# EAGLE design tiles (EAGLE 9.5.2)
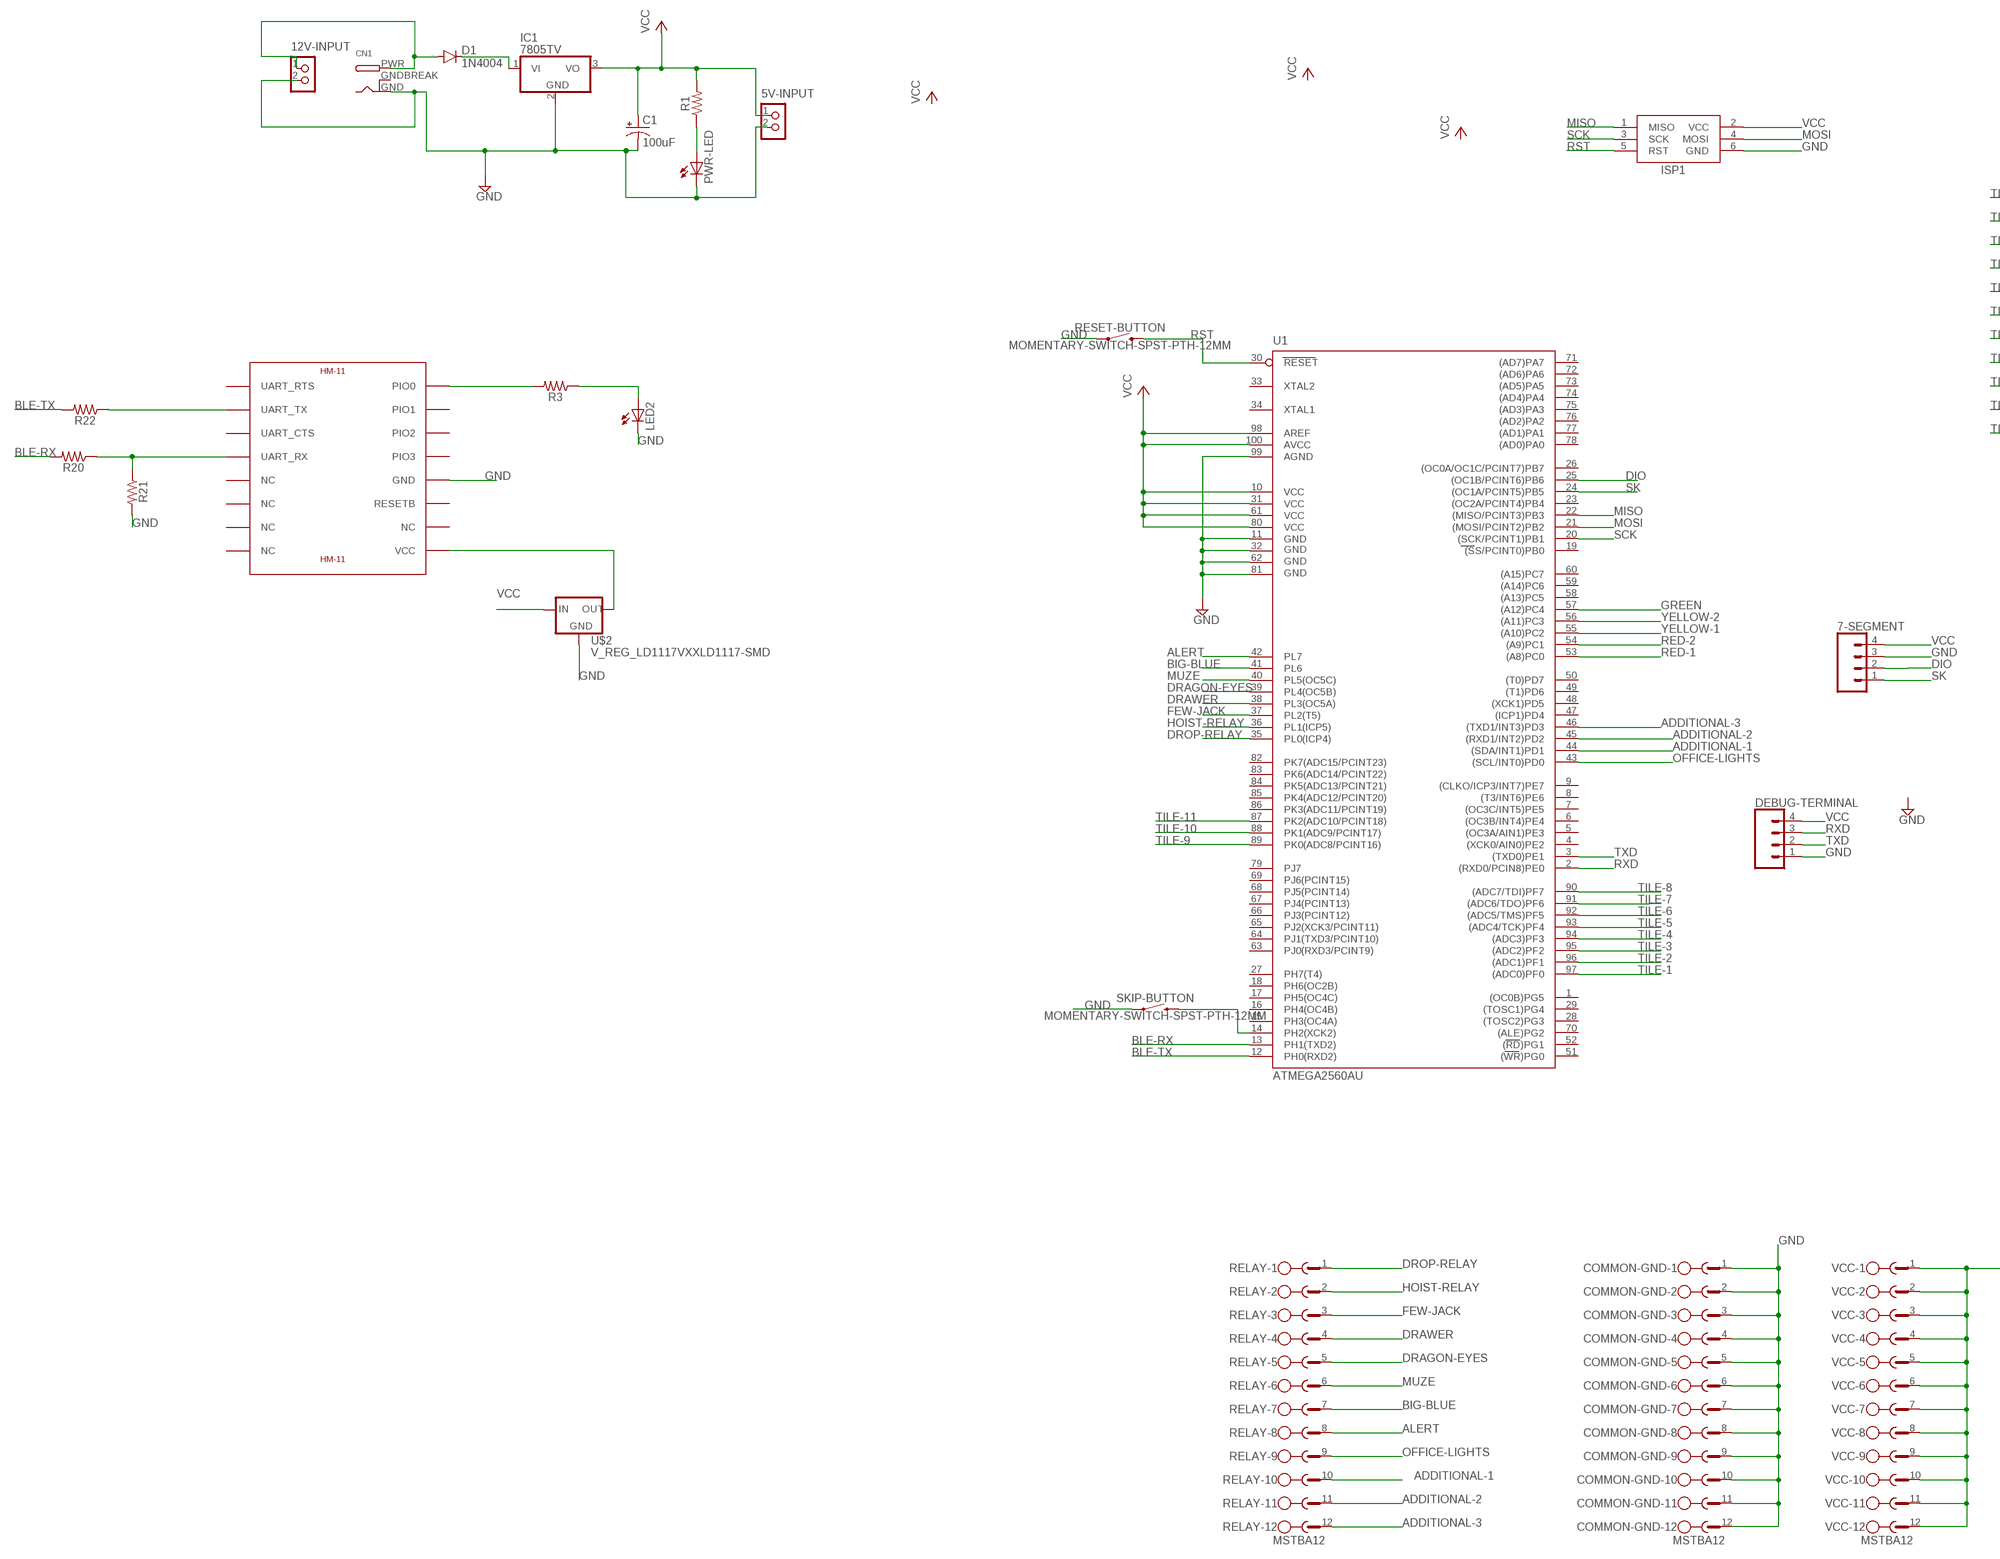
[diagram p0: schematic, sheet 1, part 1 of 2]
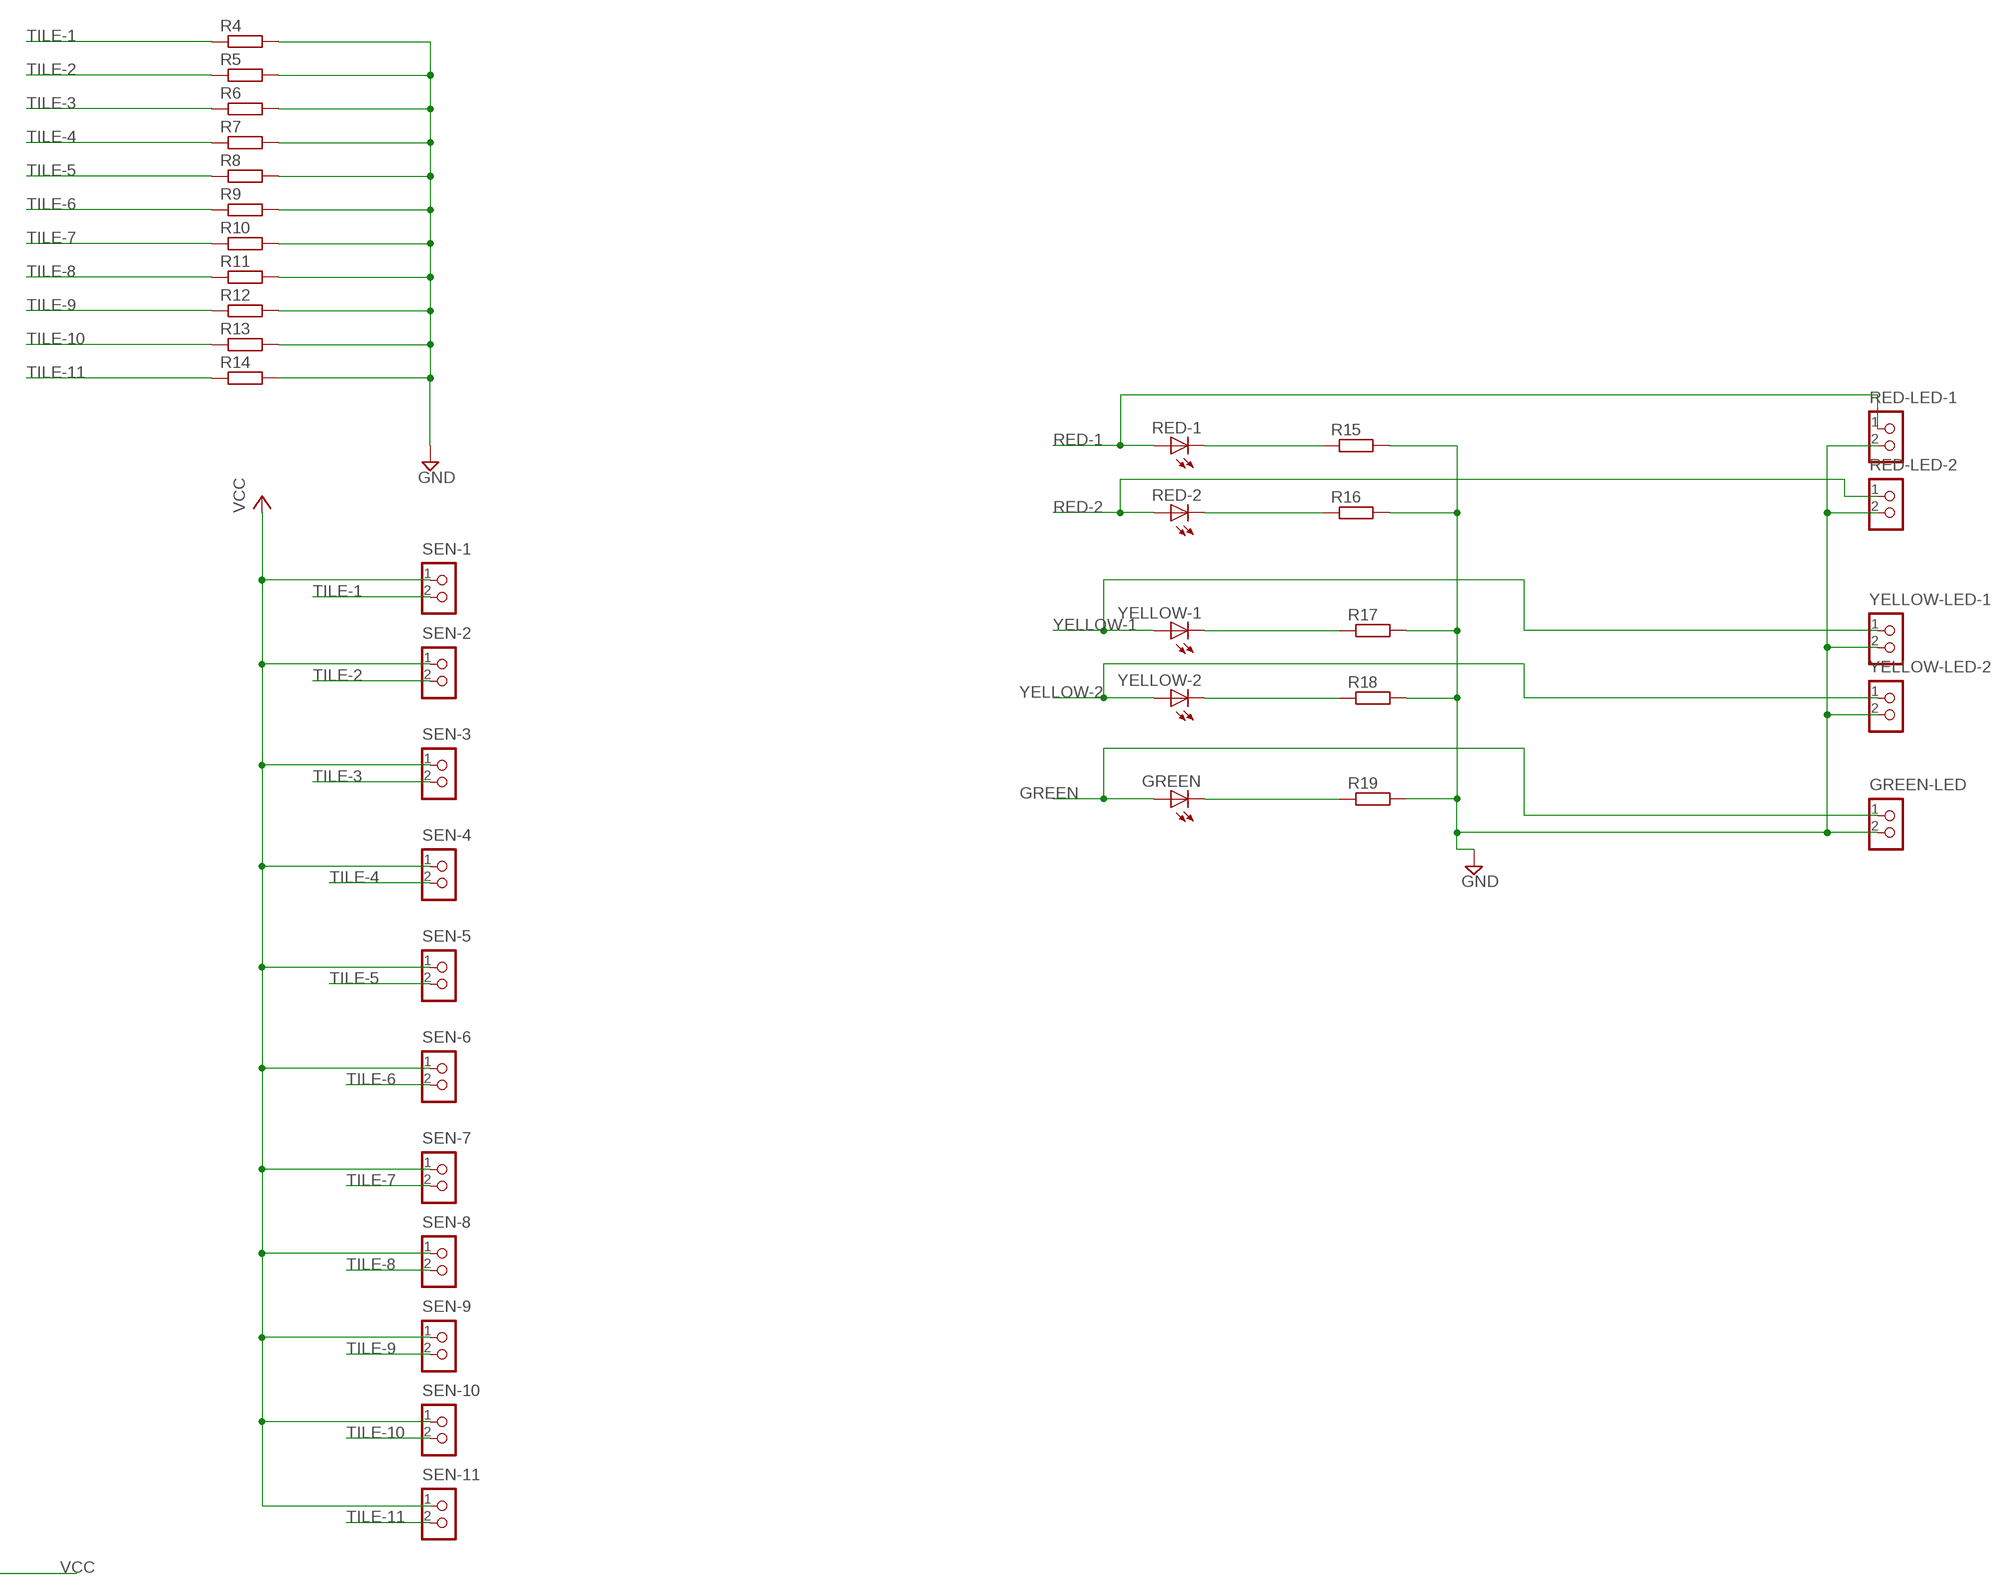
[diagram p1: schematic, sheet 1, part 2 of 2]

## Parts
5V-INPUT  CON_TERMINAL_BLOCK_02-5MM  [TERMINAL_BLOCK_2P_5]
7-SEGMENT  CONN_04PTH  [1X04]
12V-INPUT  CON_TERMINAL_BLOCK_02-5MM  [TERMINAL_BLOCK_2P_5]
C1  100uF  100UF-POLAR-RADIAL-2.5MM-25V-20%  [CPOL-RADIAL-2.5MM-6.5MM]
CN1  DCBARRELPTH  [DCJACK_2MM_PTH]
COMMON-GND  MSTBA12  [MSTBA12]
D1  1N4004  [DO41-10]
DEBUG-TERMINAL  CONN_04PTH  [1X04]
GREEN  LED5MM  [LED5MM]
GREEN-LED  CON_TERMINAL_BLOCK_02-5MM  [TERMINAL_BLOCK_2P_5]
IC1  7805TV  [TO220V]
ISP1  AVRISP-6  [AVRISP]
LED2  LED1206  [LED-1206]
PWR-LED  LED1206  [LED-1206]
R1  RESISTOR1206  [1206]
R3  RESISTOR1206  [1206]
R4  R-EU_0204/7  [0204/7]
R5  R-EU_0204/7  [0204/7]
R6  R-EU_0204/7  [0204/7]
R7  R-EU_0204/7  [0204/7]
R8  R-EU_0204/7  [0204/7]
R9  R-EU_0204/7  [0204/7]
R10  R-EU_0204/7  [0204/7]
R11  R-EU_0204/7  [0204/7]
R12  R-EU_0204/7  [0204/7]
R13  R-EU_0204/7  [0204/7]
R14  R-EU_0204/7  [0204/7]
R15  R-EU_0204/7  [0204/7]
R16  R-EU_0204/7  [0204/7]
R17  R-EU_0204/7  [0204/7]
R18  R-EU_0204/7  [0204/7]
R19  R-EU_0204/7  [0204/7]
R20  RESISTOR1206  [1206]
R21  RESISTOR1206  [1206]
R22  RESISTOR1206  [1206]
RED-1  LED5MM  [LED5MM]
RED-2  LED5MM  [LED5MM]
RED-LED-1  CON_TERMINAL_BLOCK_02-5MM  [TERMINAL_BLOCK_2P_5]
RED-LED-2  CON_TERMINAL_BLOCK_02-5MM  [TERMINAL_BLOCK_2P_5]
RELAY  MSTBA12  [MSTBA12]
RESET-BUTTON  MOMENTARY-SWITCH-SPST-PTH-12MM  [TACTILE_SWITCH_PTH_12MM]
SEN-1  CON_TERMINAL_BLOCK_02-5MM  [TERMINAL_BLOCK_2P_5]
SEN-2  CON_TERMINAL_BLOCK_02-5MM  [TERMINAL_BLOCK_2P_5]
SEN-3  CON_TERMINAL_BLOCK_02-5MM  [TERMINAL_BLOCK_2P_5]
SEN-4  CON_TERMINAL_BLOCK_02-5MM  [TERMINAL_BLOCK_2P_5]
SEN-5  CON_TERMINAL_BLOCK_02-5MM  [TERMINAL_BLOCK_2P_5]
SEN-6  CON_TERMINAL_BLOCK_02-5MM  [TERMINAL_BLOCK_2P_5]
SEN-7  CON_TERMINAL_BLOCK_02-5MM  [TERMINAL_BLOCK_2P_5]
SEN-8  CON_TERMINAL_BLOCK_02-5MM  [TERMINAL_BLOCK_2P_5]
SEN-9  CON_TERMINAL_BLOCK_02-5MM  [TERMINAL_BLOCK_2P_5]
SEN-10  CON_TERMINAL_BLOCK_02-5MM  [TERMINAL_BLOCK_2P_5]
SEN-11  CON_TERMINAL_BLOCK_02-5MM  [TERMINAL_BLOCK_2P_5]
SKIP-BUTTON  MOMENTARY-SWITCH-SPST-PTH-12MM  [TACTILE_SWITCH_PTH_12MM]
U1  ATMEGA2560AU  [TQFP100]
U$1  HM-11  [HM-11]
U$2  V_REG_LD1117VXXLD1117-SMD  [SOT223]
VCC  MSTBA12  [MSTBA12]
YELLOW-1  LED5MM  [LED5MM]
YELLOW-2  LED5MM  [LED5MM]
YELLOW-LED-1  CON_TERMINAL_BLOCK_02-5MM  [TERMINAL_BLOCK_2P_5]
YELLOW-LED-2  CON_TERMINAL_BLOCK_02-5MM  [TERMINAL_BLOCK_2P_5]

## Nets
ADDITIONAL-1: RELAY.10 U1.44((SDA/INT1)PD1)
ADDITIONAL-2: RELAY.11 U1.45((RXD1/INT2)PD2)
ADDITIONAL-3: RELAY.12 U1.46((TXD1/INT3)PD3)
ALERT: RELAY.8 U1.42(PL7)
BIG-BLUE: RELAY.7 U1.41(PL6)
BLE-RX: R20.2 U1.13(PH1(TXD2))
BLE-TX: R22.2 U1.12(PH0(RXD2))
DIO: 7-SEGMENT.2 U1.25((OC1B/PCINT6)PB6)
DRAGON-EYES: RELAY.5 U1.39(PL4(OC5B))
DRAWER: RELAY.4 U1.38(PL3(OC5A))
DROP-RELAY: RELAY.1 U1.35(PL0(ICP4))
FEW-JACK: RELAY.3 U1.37(PL2(T5))
GND: 5V-INPUT.2 7-SEGMENT.3 12V-INPUT.2 C1.2(-) CN1.GND COMMON-GND.1 COMMON-GND.2 COMMON-GND.3 COMMON-GND.4 COMMON-GND.5 COMMON-GND.6 COMMON-GND.7 COMMON-GND.8 COMMON-GND.9 COMMON-GND.10 COMMON-GND.11 COMMON-GND.12 DEBUG-TERMINAL.1 GREEN-LED.2 IC1.2(GND) ISP1.6(GND) LED2.C PWR-LED.C R4.2 R5.2 R6.2 R7.2 R8.2 R9.2 R10.2 R11.2 R12.2 R13.2 R14.2 R15.2 R16.2 R17.2 R18.2 R19.2 R21.2 RED-LED-1.2 RED-LED-2.2 RESET-BUTTON.1 SKIP-BUTTON.1 U1.11(GND) U1.32(GND1) U1.62(GND2) U1.81(GND3) U1.99(AGND) U$1.GND U$2.1(GND) YELLOW-LED-1.2 YELLOW-LED-2.2
GREEN: GREEN-LED.1 GREEN.A U1.57((A12)PC4)
HOIST-RELAY: RELAY.2 U1.36(PL1(ICP5))
MISO: ISP1.1(MISO) U1.22((MISO/PCINT3)PB3)
MOSI: ISP1.4(MOSI) U1.21((MOSI/PCINT2)PB2)
MUZE: RELAY.6 U1.40(PL5(OC5C))
N$1: 12V-INPUT.1 CN1.PWR D1.A
N$2: D1.C IC1.1(VI)
N$3: R3.2 U$1.PIO0
N$4: PWR-LED.A R1.1
N$5: R15.1 RED-1.K(C)
N$6: R16.1 RED-2.K(C)
N$7: R17.1 YELLOW-1.K(C)
N$8: R18.1 YELLOW-2.K(C)
N$9: GREEN.K(C) R19.1
N$10: SKIP-BUTTON.3 U1.14(PH2(XCK2))
N$11: LED2.A R3.1
N$12: U$1.VCC U$2.2(OUT)
N$13: R20.1 R21.1 U$1.UART_RX
N$15: R22.1 U$1.UART_TX
OFFICE-LIGHTS: RELAY.9 U1.43((SCL/INT0)PD0)
RED-1: RED-1.A RED-LED-1.1 U1.53((A8)PC0)
RED-2: RED-2.A RED-LED-2.1 U1.54((A9)PC1)
RST: ISP1.5(RST) RESET-BUTTON.3 U1.30(RESET)
RXD: DEBUG-TERMINAL.3 U1.2((RXD0/PCIN8)PE0)
SCK: ISP1.3(SCK) U1.20((SCK/PCINT1)PB1)
SK: 7-SEGMENT.1 U1.24((OC1A/PCINT5)PB5)
TILE-1: R4.1 SEN-1.2 U1.97((ADC0)PF0)
TILE-2: R5.1 SEN-2.2 U1.96((ADC1)PF1)
TILE-3: R6.1 SEN-3.2 U1.95((ADC2)PF2)
TILE-4: R7.1 SEN-4.2 U1.94((ADC3)PF3)
TILE-5: R8.1 SEN-5.2 U1.93((ADC4/TCK)PF4)
TILE-6: R9.1 SEN-6.2 U1.92((ADC5/TMS)PF5)
TILE-7: R10.1 SEN-7.2 U1.91((ADC6/TDO)PF6)
TILE-8: R11.1 SEN-8.2 U1.90((ADC7/TDI)PF7)
TILE-9: R12.1 SEN-9.2 U1.89(PK0(ADC8/PCINT16))
TILE-10: R13.1 SEN-10.2 U1.88(PK1(ADC9/PCINT17))
TILE-11: R14.1 SEN-11.2 U1.87(PK2(ADC10/PCINT18))
TXD: DEBUG-TERMINAL.2 U1.3((TXD0)PE1)
VCC: 5V-INPUT.1 7-SEGMENT.4 C1.1(+) DEBUG-TERMINAL.4 IC1.3(VO) ISP1.2(VCC) R1.2 SEN-1.1 SEN-2.1 SEN-3.1 SEN-4.1 SEN-5.1 SEN-6.1 SEN-7.1 SEN-8.1 SEN-9.1 SEN-10.1 SEN-11.1 U1.10(VCC) U1.31(VCC1) U1.61(VCC2) U1.80(VCC3) U1.98(AREF) U1.100(AVCC) U$2.3(IN) VCC.1 VCC.2 VCC.3 VCC.4 VCC.5 VCC.6 VCC.7 VCC.8 VCC.9 VCC.10 VCC.11 VCC.12
YELLOW-1: U1.55((A10)PC2) YELLOW-1.A YELLOW-LED-1.1
YELLOW-2: U1.56((A11)PC3) YELLOW-2.A YELLOW-LED-2.1
Unconnected: U1.1((OC0B)PG5) U1.4((XCK0/AIN0)PE2) U1.5((OC3A/AIN1)PE3) U1.6((OC3B/INT4)PE4) U1.7((OC3C/INT5)PE5) U1.8((T3/INT6)PE6) U1.9((CLKO/ICP3/INT7)PE7) U1.15(PH3(OC4A)) U1.16(PH4(OC4B)) U1.17(PH5(OC4C)) U1.18(PH6(OC2B)) U1.19((SS/PCINT0)PB0) U1.23((OC2A/PCINT4)PB4) U1.26((OC0A/OC1C/PCINT7)PB7) U1.27(PH7(T4)) U1.28((TOSC2)PG3) U1.29((TOSC1)PG4) U1.33(XTAL2) U1.34(XTAL1) U1.47((ICP1)PD4) U1.48((XCK1)PD5) U1.49((T1)PD6) U1.50((T0)PD7) U1.51((WR)PG0) U1.52((RD)PG1) U1.58((A13)PC5) U1.59((A14)PC6) U1.60((A15)PC7) U1.63(PJ0(RXD3/PCINT9)) U1.64(PJ1(TXD3/PCINT10)) U1.65(PJ2(XCK3/PCINT11)) U1.66(PJ3(PCINT12)) U1.67(PJ4(PCINT13)) U1.68(PJ5(PCINT14)) U1.69(PJ6(PCINT15)) U1.70((ALE)PG2) U1.71((AD7)PA7) U1.72((AD6)PA6) U1.73((AD5)PA5) U1.74((AD4)PA4) U1.75((AD3)PA3) U1.76((AD2)PA2) U1.77((AD1)PA1) U1.78((AD0)PA0) U1.79(PJ7) U1.82(PK7(ADC15/PCINT23)) U1.83(PK6(ADC14/PCINT22)) U1.84(PK5(ADC13/PCINT21)) U1.85(PK4(ADC12/PCINT20)) U1.86(PK3(ADC11/PCINT19)) U$1.NC@5(NC) U$1.NC@6(NC) U$1.NC@7(NC) U$1.NC@8(NC) U$1.NC@10(NC) U$1.PIO1 U$1.PIO2 U$1.PIO3 U$1.RESETB U$1.UART_CTS U$1.UART_RTS

## Power pins joined to a net without a drawn wire
GNDBREAK: CN1.GNDBREAK

## Library data of the parts
5V-INPUT 12V-INPUT GREEN-LED RED-LED-1 RED-LED-2 SEN-1-SEN-11 YELLOW-LED-1 YELLOW-LED-2 = dp_devices.v6:CON_TERMINAL_BLOCK_02: 2 poles wire to board terminal block
7-SEGMENT DEBUG-TERMINAL = SparkFun-Connectors:CONN_04: Multi connection point. Often used as Generic Header-pin footprint for 0.1 inch spaced/style header connections On any of the 0.1 inch spaced packages, you can populate with these: Break Away Headers - Straight <https://www.sparkfun.com/products/116> (PRT-00116) Break Away Male Headers - Right Angle <https://www.sparkfun.com/products/553> (PRT-00553) Female Headers <https://www.sparkfun.com/products/115> (PRT-00115) Break Away Headers - Machine Pin <https://www.sparkfun.com/products/117> (PRT-00117) Break Away Female Headers - Swiss Machine Pin <https://www.sparkfun.com/products/743> (PRT-00743) For SCREWTERMINALS and SPRING TERMINALS visit here: Screw Terimnals on SparkFun.com <https://www.sparkfun.com/search/results?term=Screw+Terminals> (5mm/3.5mm/2.54mm spacing) This device is also useful as a general connection point to wire up your design to another part of your project. Our various solder wires solder well into these plated through hole pads. Hook-Up Wire - Assortment (Stranded, 22 AWG) <https://www.sparkfun.com/products/11375> (PRT-11375) Hook-Up Wire - Assortment (Solid Core, 22 AWG) <https://www.sparkfun.com/products/11367> (PRT-11367) View the entire wire category on our website here <https://www.sparkfun.com/categories/141> Special notes: Molex polarized connector foot print use with SKU : PRT-08231 with associated crimp pins and housings. 1MM SMD Version SKU: PRT-10208; PROD_ID: CONN-09696
C1 = SparkFun-Capacitors:100UF-POLAR: 100µF polarized capacitors A capacitor is a passive two-terminal electrical component used to store electrical energy temporarily in an electric field.; PROD_ID: CAP-08439
CN1 = adafruit:DCBARREL: 2.0mm DC Barrel Jack DCJACK_2MM_PTH - Through Hole Jack (4UConnector: 05537)
COMMON-GND RELAY VCC = con-phoenix-508:MSTBA12: PHOENIX; MPN: 1757349; OC_FARNELL: 3705250; OC_NEWARK: 71C4169
D1 = diode:1N4004: DIODE general purpose rectifier, 1 A
GREEN RED-1 RED-2 YELLOW-1 YELLOW-2 = adafruit:LED: LED OSRAM: - CHIPLED LG R971, LG N971, LY N971, LG Q971, LY Q971, LO R971, LY R971 LH N974, LH R974 LS Q976, LO Q976, LY Q976 LO Q996 - Hyper CHIPLED LW Q18S LB Q993, LB Q99A, LB R99A - SideLED LS A670, LO A670, LY A670, LG A670, LP A670 LB A673, LV A673, LT A673, LW A673 LH A674 LY A675 LS A676, LA A676, LO A676, LY A676, LW A676 LS A679, LY A679, LG A679 - Hyper Micro SIDELED® LS Y876, LA Y876, LO Y876, LY Y876 LT Y87S - SmartLED LW L88C, LW L88S LB L89C, LB L89S, LG L890 LS L89K, LO L89K, LY L89K LS L896, LA L896, LO L896, LY L896 - TOPLED LS T670, LO T670, LY T670, LG T670, LP T670 LSG T670, LSP T670, LSY T670, LOP T670, LYG T670 LG T671, LOG T671, LSG T671 LB T673, LV T673, LT T673, LW T673 LH T674 LS T676, LA T676, LO T676, LY T676, LB T676, LH T676, LSB T676, LW T676 LB T67C, LV T67C, LT T67C, LS T67K, LO T67K, LY T67K, LW E67C LS E67B, LA E67B, LO E67B, LY E67B, LB E67C, LV E67C, LT E67C LW T67C LS T679, LY T679, LG T679 LS T770, LO T770, LY T770, LG T770, LP T770 LB T773, LV T773, LT T773, LW T773 LH T774 LS E675, LA E675, LY E675, LS T675 LS T776, LA T776, LO T776, LY T776, LB T776 LHGB T686 LT T68C, LB T68C - Hyper Mini TOPLED® LB M676 - Mini TOPLED Santana® LG M470 LS M47K, LO M47K, LY M47K Source: http://www.osram.convergy.de/
IC1 = linear:78*: Positive VOLTAGE REGULATOR Source: http://cache.national.com/ds/LM/LM78L05.pdf http://www.fairchildsemi.com/ds/LM/LM7805.pdf
ISP1 = adafruit:AVRISP: AVR ISP HEADER Standard 6 pin header for AVR programming
LED2 PWR-LED = SparkFun-Retired:LED: LEDs Standard schematic elements and footprints for 5mm, 3mm, 1206, and 0603 sized LEDs. 5mm - Spark Fun Electronics SKU : Comp-SBL
R1 R3 R20-R22 = SparkFun-Resistors:RESISTOR: Generic Resistor Package; SPICEPREFIX: R
R4-R19 = rcl:R-EU_: RESISTOR, European symbol; SPICEPREFIX: R
RESET-BUTTON SKIP-BUTTON = SparkFun-Switches:MOMENTARY-SWITCH-SPST: Momentary Switch (Pushbutton) - SPST Normally-open (NO) SPST momentary switches (buttons, pushbuttons). Variants PTH-12MM - 12mm square, through-hole Momentary Pushbutton Switch - 12mm Square <https://www.sparkfun.com/products/9190> (COM-09190) PTH-6.0MM, PTH-6.0MM-KIT - 6.0mm square, through-hole Mini Pushbutton Switch <https://www.sparkfun.com/products/97> (COM-00097) KIT package intended for soldering kit's - only one side of pads' copper is exposed. PTH-RIGHT-ANGLE-KIT - Right-angle, through-hole Right Angle Tactile Button <https://www.sparkfun.com/products/10791> - Used on SparkFun BigTime Watch Kit <https://www.sparkfun.com/products/11734> SMD-12MM - 12mm square, surface-mount Tactile Button - SMD (12mm) <https://www.sparkfun.com/products/12993> (COM-12993) Used on SparkFun PicoBoard <https://www.sparkfun.com/products/11888> SMD-4.5MM - 4.5mm Square Trackball Switch Used on SparkFun Blackberry Trackballer Breakout <https://www.sparkfun.com/products/13169> SMD-4.6MMX2.8MM - 4.60mm x 2.80mm, surface mount Used on SparkFun SAMD21 Mini Breakout <https://www.sparkfun.com/products/13664> SMD-5.2MM, SMD-5.2-REDUNDANT - 5.2mm square, surface-mount Mini Pushbutton Switch - SMD <https://www.sparkfun.com/products/8720> (COM-08720) Used on Arduino Pro Mini <https://www.sparkfun.com/products/11114> REDUNDANT package connects both switch circuits together SMD-6.0X3.5MM - 6.0 x 3.5mm, surface mount Momentary Reset Switch SMD <https://www.sparkfun.com/products/8229> (COM-08229) SMD-6.2MM-TALL - 6.2mm square, surface mount Tactile Button - SMD (6mm) <https://www.sparkfun.com/products/12992> Used on SparkFun Digital Sandbox <https://www.sparkfun.com/products/12651> SMD-RIGHT-ANGLE - Right-angle, surface mount Used on SparkFun Block for Intel® Edison - Arduino <https://www.sparkfun.com/products/13036>; PROD_ID: SWCH-09185; SF_SKU: COM-09190
U1 = SparkFun-IC-Microcontroller:ATMEGA2560: Atmel 100-pin 8-bit uC 64/128/256 Kbytes FLASH 4 Kbytes EEPROM 8 Kbytes SRAM 86 General Purpose I/O pins 12-channels16-bit PWM 4 x Serial USARTs 16-channels 10-bit A/D SparkFun Products None.; PROD_ID: IC-10040
U$1 = hm-11:HM-11: JNHuaMao HM-11 Bluetooth 4.0 Transceiver based on TI CC2540/CC2541
U$2 = SparkFun-IC-Power:V_REG_LD1117VXX: LD1117VXX voltage regulator. We carry the 3.3V version (COM-00526) in TO-220 package.; PROD_ID: VREG-13917; SPICEPREFIX: U

## Board
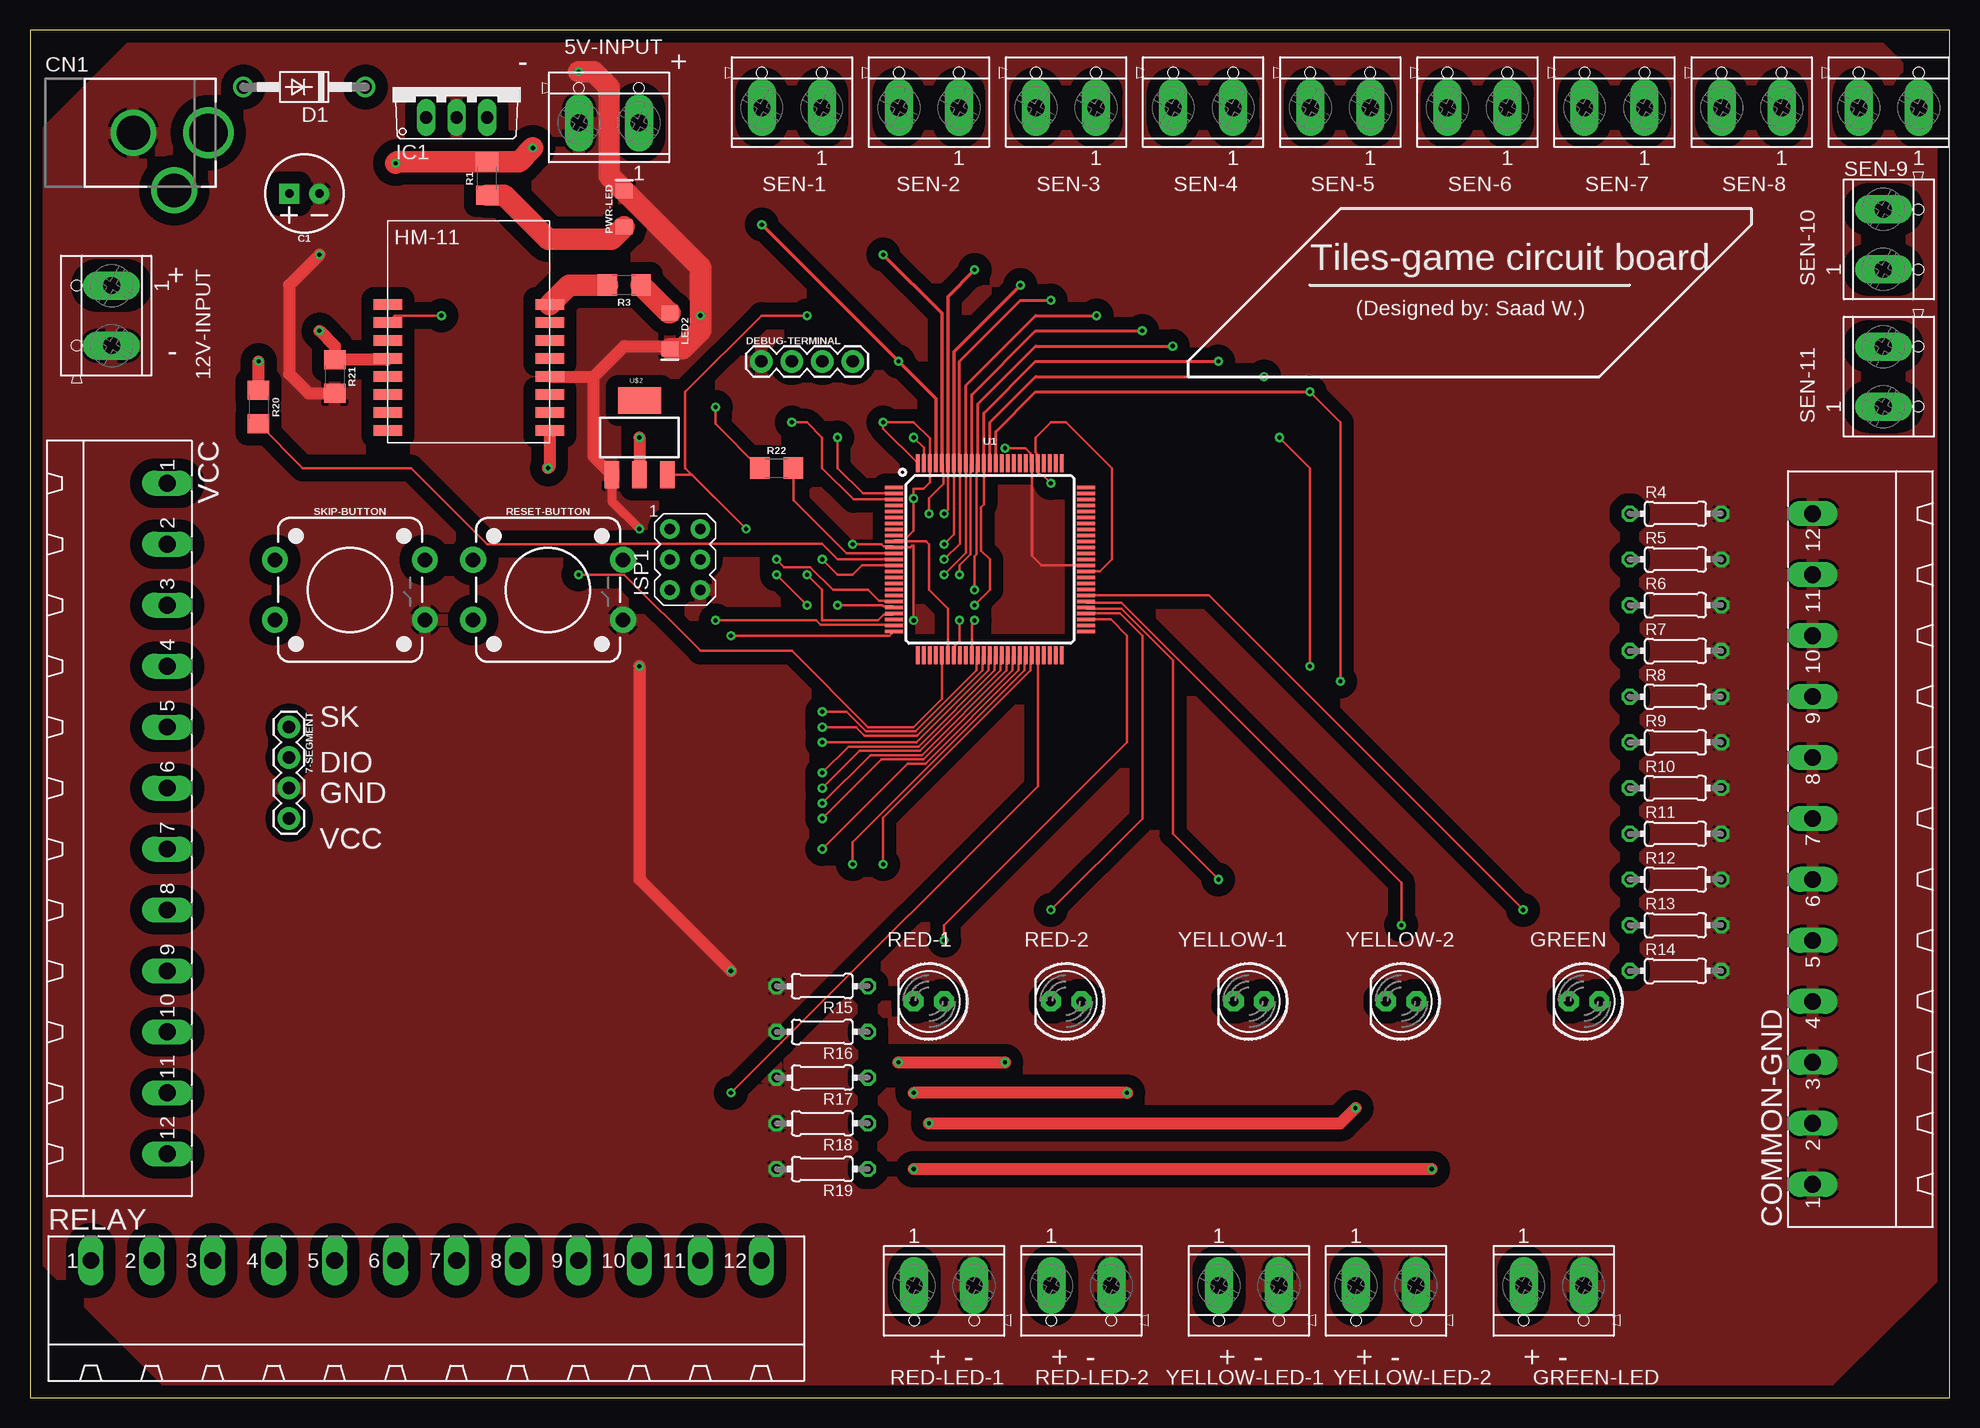
[diagram p2: board, top side]
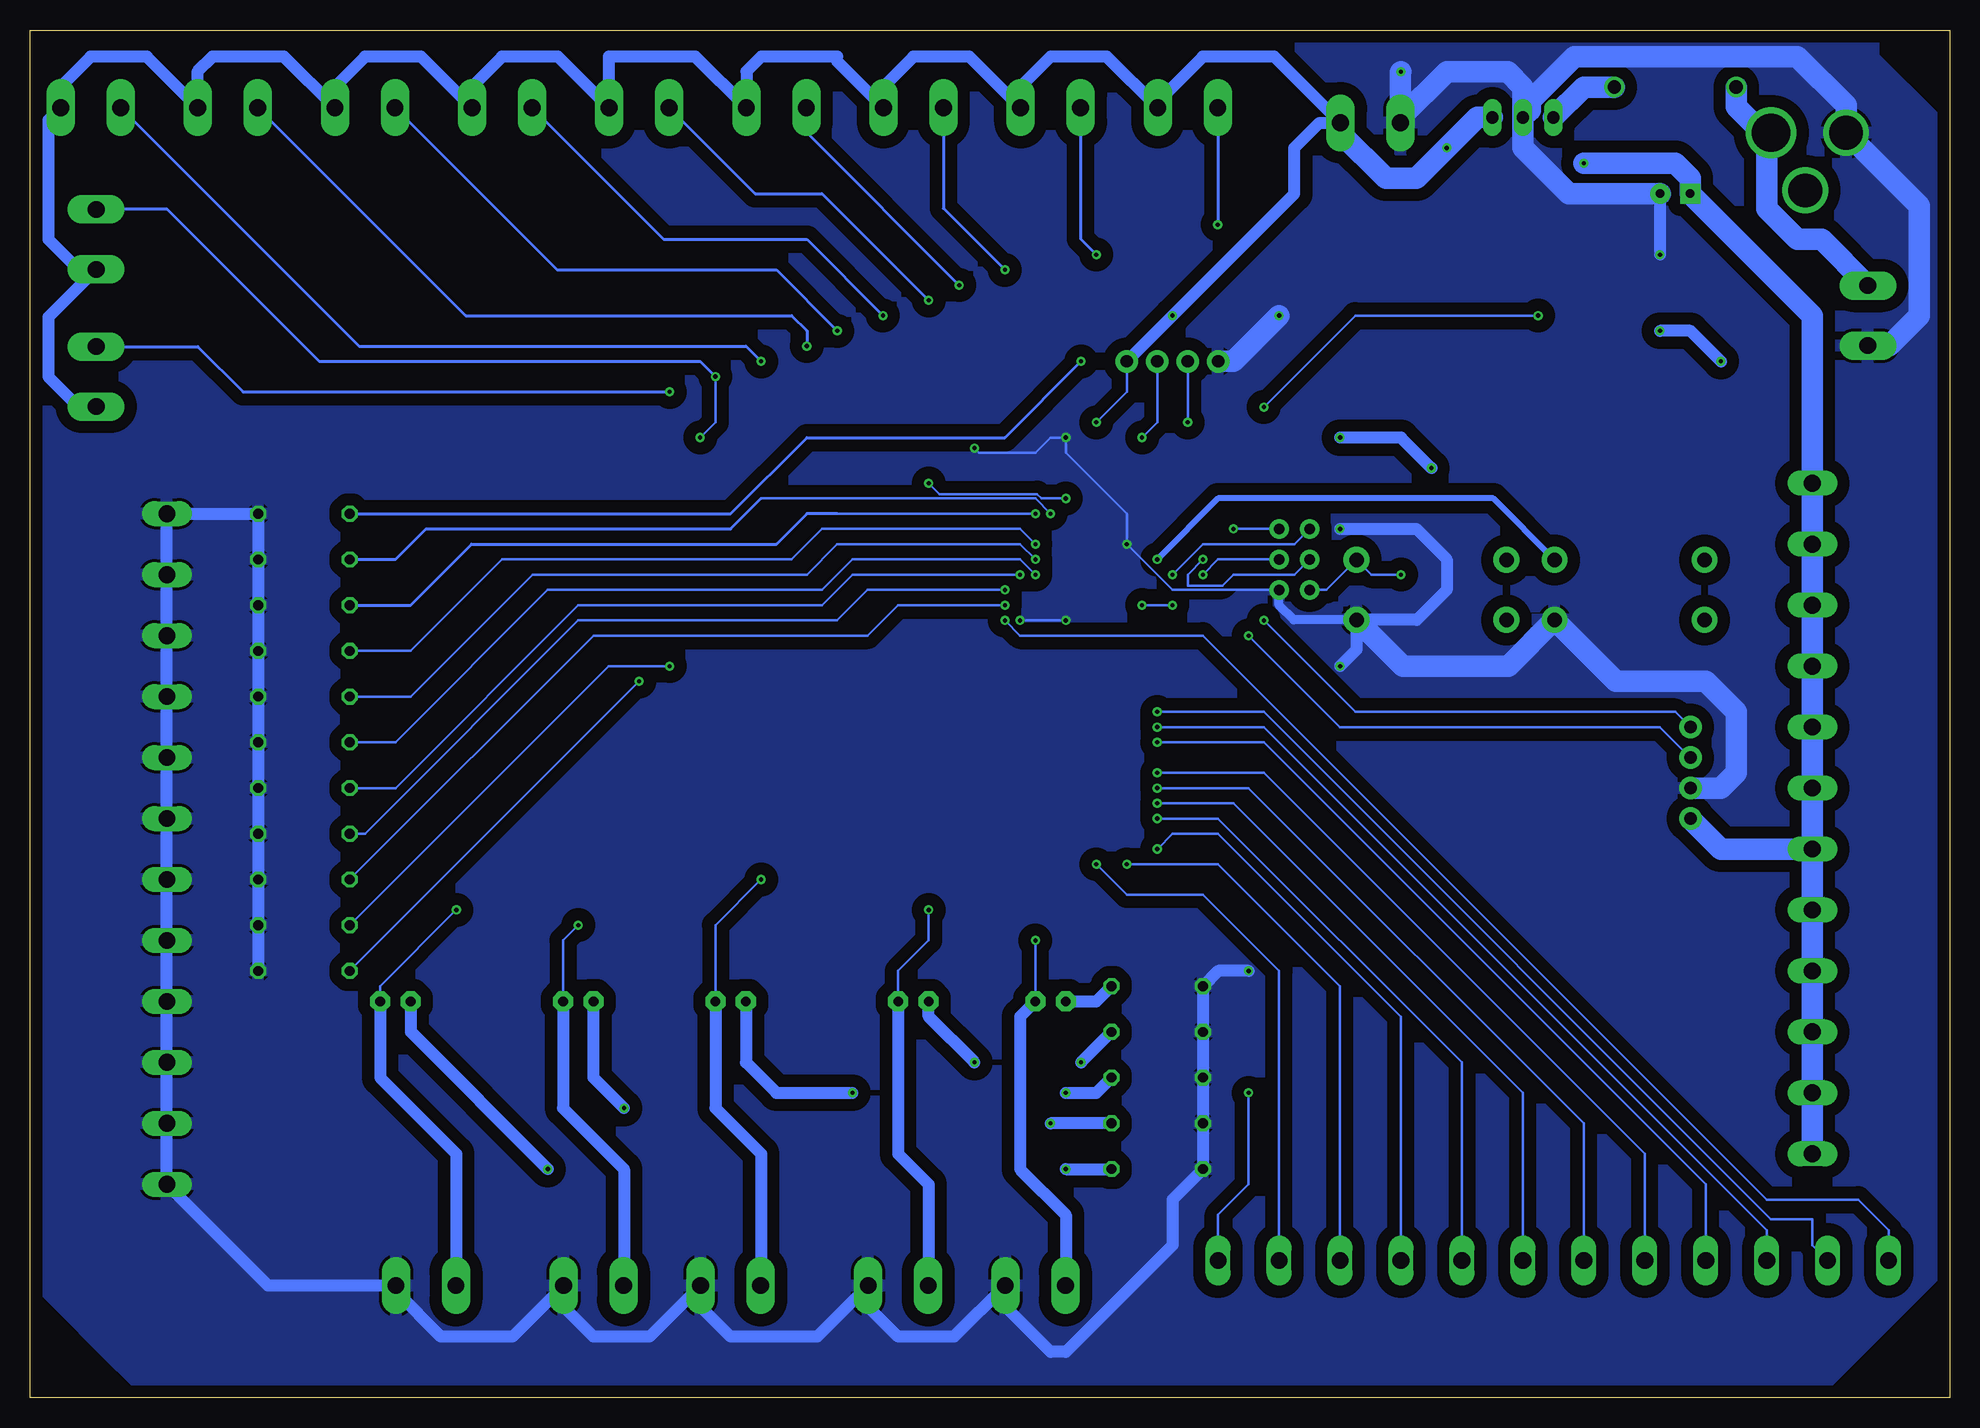
[diagram p3: board, bottom side, seen from below]

Size 160 x 113.97 mm. Coordinates in mm from the lower left corner, seen from the top.
Outline: 0,0 160,0 160,113.97 0,113.97 0,0
Copper layers (1*16): Top 0.035mm / dielectric 1.5mm / Bottom 0.035mm
Design rules "default": minimum track width 6mil, minimum drill 0.35mm, track to track 6mil, track to pad 6mil, pad to pad 6mil, via to via 6mil, smd to smd 6mil, copper to edge 40mil, drill to drill 6mil, minimum pad ring 10mil, minimum via ring 8mil, stop-mask expansion 4mil, vias tented up to drill 0mil, thermal gap 10mil

### Footprints (pad centres in the part's own frame; a part is rotated, then mirrored left to right if it is on the bottom)
TERMINAL_BLOCK_2P_5 = drill 1.4 pad 2.38 long: 1 2.5,-0.45; 2 -2.5,-0.45
1X04 = drill 1.016 pad 1.88: 1 0,0; 2 2.54,0; 3 5.08,0; 4 7.62,0
CPOL-RADIAL-2.5MM-6.5MM = drill 0.7 pad 1.651 square: 1 1.25,0 | drill 0.7 pad 1.651: 2 -1.25,0
DCJACK_2MM_PTH = drill 2.8: GND 0,7.35; GNDBREAK 4.8,10.75 | drill 3.2: PWR 0,13.6
MSTBA12 = drill 1.397 long: 1 -27.94,5.08; 2 -22.86,5.08; 3 -17.78,5.08; 4 -12.7,5.08; 5 -7.62,5.08; 6 -2.54,5.08; 7 2.54,5.08; 8 7.62,5.08; 9 12.7,5.08; 10 17.78,5.08; 11 22.86,5.08; 12 27.94,5.08
DO41-10 = drill 1.118: A 5.08,0; C -5.08,0
LED5MM = drill 0.813 pad 1.676 octagon: A -1.27,0; K 1.27,0
TO220V = drill 1.016 long: 1 -2.54,-2.54; 2 0,-2.54; 3 2.54,-2.54
AVRISP = drill 0.9 pad 1.626: 1 -1.27,2.54; 2 1.27,2.54; 3 -1.27,0; 4 1.27,0; 5 -1.27,-2.54; 6 1.27,-2.54
LED-1206 = smd 1.2 x 1.4: A -1.5,0; C 1.5,0
1206 = smd 1.6 x 1.8: 1 -1.4,0; 2 1.4,0
0204/7 = drill 0.813 octagon: 1 -3.81,0; 2 3.81,0
TACTILE_SWITCH_PTH_12MM = drill 1.2 pad 2.159: 1 6.25,-2.5; 2 -6.25,-2.5; 3 6.25,2.5; 4 -6.25,2.5
TQFP100 = smd 1.5 x 0.3: 1 -8,6; 2 -8,5.5; 3 -8,5; 4 -8,4.5; 5 -8,4; 6 -8,3.5; 7 -8,3; 8 -8,2.5; 9 -8,2; 10 -8,1.5; 11 -8,1; 12 -8,0.5; 13 -8,0; 14 -8,-0.5; 15 -8,-1; 16 -8,-1.5; 17 -8,-2; 18 -8,-2.5; 19 -8,-3; 20 -8,-3.5; 21 -8,-4; 22 -8,-4.5; 23 -8,-5; 24 -8,-5.5; 25 -8,-6; 51 8,-6; 52 8,-5.5; 53 8,-5; 54 8,-4.5; 55 8,-4; 56 8,-3.5; 57 8,-3; 58 8,-2.5; 59 8,-2; 60 8,-1.5; 61 8,-1; 62 8,-0.5; 63 8,0; 64 8,0.5; 65 8,1; 66 8,1.5; 67 8,2; 68 8,2.5; 69 8,3; 70 8,3.5; 71 8,4; 72 8,4.5; 73 8,5; 74 8,5.5; 75 8,6 | smd 0.3 x 1.5: 26 -6,-8; 27 -5.5,-8; 28 -5,-8; 29 -4.5,-8; 30 -4,-8; 31 -3.5,-8; 32 -3,-8; 33 -2.5,-8; 34 -2,-8; 35 -1.5,-8; 36 -1,-8; 37 -0.5,-8; 38 0,-8; 39 0.5,-8; 40 1,-8; 41 1.5,-8; 42 2,-8; 43 2.5,-8; 44 3,-8; 45 3.5,-8; 46 4,-8; 47 4.5,-8; 48 5,-8; 49 5.5,-8; 50 6,-8; 76 6,8; 77 5.5,8; 78 5,8; 79 4.5,8; 80 4,8; 81 3.5,8; 82 3,8; 83 2.5,8; 84 2,8; 85 1.5,8; 86 1,8; 87 0.5,8; 88 0,8; 89 -0.5,8; 90 -1,8; 91 -1.5,8; 92 -2,8; 93 -2.5,8; 94 -3,8; 95 -3.5,8; 96 -4,8; 97 -4.5,8; 98 -5,8; 99 -5.5,8; 100 -6,8
HM-11 = smd 2.4 x 0.9: GND 6.5,0; NC@5 -7,0; NC@6 -7,-1.5; NC@7 -7,-3; NC@8 -7,-4.5; NC@10 6.5,-3; PIO0 6.5,6; PIO1 6.5,4.5; PIO2 6.5,3; PIO3 6.5,1.5; RESETB 6.5,-1.5; UART_CTS -7,3; UART_RTS -7,6; UART_RX -7,1.5; UART_TX -7,4.5; VCC 6.5,-4.5
SOT223 = smd 1.219 x 2.235: 1 -2.311,-3.099; 2 0,-3.099; 3 2.311,-3.099 | smd 3.6 x 2.2: 4 0,3.099

### Placement (x,y rotation side)
5V-INPUT  48.26,106.68 0 top
7-SEGMENT  21.59,55.88 270 top
12V-INPUT  6.35,90.17 90 top
C1  22.86,100.33 180 top
CN1  1.27,105.41 270 top
COMMON-GND  153.67,45.72 90 top
D1  22.86,109.22 180 top
DEBUG-TERMINAL  60.96,86.36 0 top
GREEN  129.54,33.02 180 top
GREEN-LED  127,8.89 180 top
IC1  35.56,109.22 0 top
ISP1  54.61,69.85 0 top
LED2  53.34,88.9 270 top
PWR-LED  49.53,99.06 90 top
R1  38.1,101.6 90 top
R3  49.53,92.71 180 top
R4  137.16,73.66 0 top
R5  137.16,69.85 0 top
R6  137.16,66.04 0 top
R7  137.16,62.23 0 top
R8  137.16,58.42 0 top
R9  137.16,54.61 0 top
R10  137.16,50.8 0 top
R11  137.16,46.99 0 top
R12  137.16,43.18 0 top
R13  137.16,39.37 0 top
R14  137.16,35.56 0 top
R15  66.04,34.29 180 top
R16  66.04,30.48 180 top
R17  66.04,26.67 180 top
R18  66.04,22.86 180 top
R19  66.04,19.05 180 top
R20  19.05,82.55 270 top
R21  25.4,85.09 270 top
R22  62.23,77.47 0 top
RED-1  74.93,33.02 180 top
RED-2  86.36,33.02 180 top
RED-LED-1  76.2,8.89 180 top
RED-LED-2  87.63,8.89 180 top
RELAY  33.02,6.35 0 top
RESET-BUTTON  43.18,67.31 0 top
SEN-1  63.5,107.95 0 top
SEN-2  74.93,107.95 0 top
SEN-3  86.36,107.95 0 top
SEN-4  97.79,107.95 0 top
SEN-5  109.22,107.95 0 top
SEN-6  120.65,107.95 0 top
SEN-7  132.08,107.95 0 top
SEN-8  143.51,107.95 0 top
SEN-9  154.94,107.95 0 top
SEN-10  154.94,96.52 270 top
SEN-11  154.94,85.09 270 top
SKIP-BUTTON  26.67,67.31 0 top
U1  80.01,69.85 0 top
U$1  36.83,85.09 0 top
U$2  50.8,80.01 0 top
VCC  6.35,48.26 270 top
YELLOW-1  101.6,33.02 180 top
YELLOW-2  114.3,33.02 180 top
YELLOW-LED-1  101.6,8.89 180 top
YELLOW-LED-2  113.03,8.89 180 top

### Tracks (layer width: path | path; a pad name or v marks a point on that pad's centre or on a via)
ADDITIONAL-1  (via drill 0.35)
  Top 0.203: U1.44 82.91,61.75 82.91,60.61 68.58,46.27 v68.58,44.45
  Bottom 0.203: RELAY.10 50.8,34.29 60.96,44.45 v68.58,44.45
ADDITIONAL-2  (via drill 0.35)
  Top 0.203: v71.12,44.45 71.12,48.31 83.41,60.61 83.41,61.75 U1.45
  Bottom 0.203: RELAY.11 55.88,35.56 62.23,41.91 68.58,41.91 v71.12,44.45
ADDITIONAL-3  (via drill 0.35)
  Top 0.203: v58.42,25.4 62.59,29.57 62.61,29.57 84.01,50.97 U1.46
  Bottom 0.203: RELAY.12 60.96,15.24 58.42,17.78 v58.42,25.4
ALERT  (via drill 0.35)
  Top 0.203: U1.42 81.91,61.75 81.91,60.61 74.49,53.19 70.97,53.19 v66.04,48.26
  Bottom 0.203: v66.04,48.26 60.96,48.26 40.64,27.94 RELAY.8
BIG-BLUE  (via drill 0.35)
  Top 0.203: v66.04,49.53 70.05,53.54 74.34,53.54 81.41,60.62 81.41,61.75 U1.41
  Bottom 0.203: RELAY.7 35.56,25.4 59.69,49.53 v66.04,49.53
BLE-RX
  Top 0.203: U1.13 67.31,69.85 66.02,71.14 48.88,71.14 48.85,71.12 38.1,71.12 31.75,77.47 22.73,77.47 R20.2
BLE-TX
  Top 0.203: U1.12 68.08,70.35 63.63,74.8 R22.2
DIO  (via drill 0.35)
  Top 0.203: U1.25 71.66,63.5 v58.42,63.5
  Bottom 0.203: v58.42,63.5 50.8,55.88 24.13,55.88 7-SEGMENT.2
DRAGON-EYES  (via drill 0.35)
  Top 0.203: v66.04,52.07 68.22,54.25 74.05,54.25 80.41,60.62 80.41,61.75 U1.39
  Bottom 0.203: RELAY.5 25.4,20.32 57.15,52.07 v66.04,52.07
DRAWER  (via drill 0.35)
  Top 0.203: U1.38 79.91,61.75 79.91,60.62 73.9,54.61 v66.04,54.61
  Bottom 0.203: RELAY.4 20.32,17.78 57.15,54.61 v66.04,54.61
DROP-RELAY  (via drill 0.35)
  Top 0.203: U1.35 78.51,64.54 v78.74,64.77
  Bottom 0.203: v78.74,64.77 77.47,63.5 62.23,63.5 15.24,16.51 7.62,16.51 5.08,13.97 RELAY.1
FEW-JACK  (via drill 0.35)
  Top 0.203: U1.37 79.41,61.75 79.41,60.63 73.95,55.17 69.56,55.17 68.84,55.88 v66.04,55.88
  Bottom 0.203: v66.04,55.88 57.15,55.88 15.24,13.97 RELAY.3
GND  (via drill 0.35)
  Top 0.203: U1.62 84.32,69.35 83.51,70.16 U1.81 83.41,77.95 83.41,78.7 82.99,79.13 v81.28,79.13 | U1.99 74.51,79.16 v73.66,80.01 | v68.58,71.12 70.98,71.12 71.16,70.95 71.91,70.95 U1.11 73.39,70.85 73.53,70.99 73.66,70.99 v73.66,64.77 | U1.32 77.11,61.95 77.11,62.7 77.47,63.07 v77.47,64.77
  Top 0.762: U$2.1 48.49,74.7 v50.8,72.39
  Top 1.016: 46.99,85.09 49.53,87.63 53.11,87.63 LED2.C | U$1.GND 46.99,85.09 | U$2.1 46.99,78.41 46.99,85.09 | v24.13,95.25 21.59,92.71 21.59,85.31 23.21,83.69 R21.2 | v50.8,60.96 50.8,43.18 v58.42,35.56
  Top 1.778: v45.72,110.49 46.99,110.49 48.26,109.22 48.26,101.83 PWR-LED.C 55.88,94.21 v55.88,90.17 55.88,88.9 54.38,87.4 LED2.C
  Bottom 0.203: v81.28,79.13 80.89,78.74 76.2,78.74 74.93,80.01 v73.66,80.01 73.66,78.74 68.58,73.66 v68.58,71.12 64.77,67.31 ISP1.6 | v73.66,64.77 v77.47,64.77
  Bottom 0.762: RESET-BUTTON.1 54.65,64.81 55.88,66.04 ISP1.6
  Bottom 1.016: v24.13,95.25 24.11,95.27 C1.2 | v50.8,72.39 44.45,72.39 41.91,69.85 41.91,67.31 44.41,64.81 RESET-BUTTON.1 49.43,62.33 v50.8,60.96 | v58.42,35.56 60.96,35.56 R15.2 R16.2 R17.2 R18.2 R19.2 64.77,16.51 64.77,12.7 73.66,3.81 74.93,3.81 78.7,7.58 RED-LED-1.2 82.96,5.08 87.63,5.08 90.13,7.58 RED-LED-2.2 94.39,5.08 101.6,5.08 104.1,7.58 YELLOW-LED-1.2 108.36,5.08 113.03,5.08 115.53,7.58 YELLOW-LED-2.2 119.79,5.08 125.73,5.08 129.5,8.85 GREEN-LED.2 140.15,9.34 COMMON-GND.1 COMMON-GND.2 COMMON-GND.3 COMMON-GND.4 COMMON-GND.5 COMMON-GND.6 COMMON-GND.7 COMMON-GND.8 COMMON-GND.9 COMMON-GND.10 COMMON-GND.11 COMMON-GND.12 R4.2 R5.2 R6.2 R7.2 R8.2 R9.2 R10.2 R11.2 R12.2 R13.2 R14.2
  Bottom 1.778: 12V-INPUT.2 5.04,87.67 2.54,90.17 2.54,99.33 CN1.GND 8.62,107.68 12.7,111.76 31.25,111.76 34.95,108.06 34.95,107.29 IC1.2 | IC1.2 35.56,109.22 36.83,110.49 41.91,110.49 45.76,106.64 | 45.76,106.64 5V-INPUT.2 | IC1.2 35.56,104.14 31.75,100.33 C1.2 | 7-SEGMENT.3 19.05,50.8 17.78,52.07 17.78,57.15 20.32,59.69 27.8,59.69 SKIP-BUTTON.1 36.77,60.96 45.58,60.96 RESET-BUTTON.1 | v45.72,110.49 45.76,110.45 45.76,106.64 | DEBUG-TERMINAL.1 59.69,86.36 v55.88,90.17
  pour Top (isolate 1.016): 7.62,111.76 1.27,105.41 1.27,101.6 1.27,11.43 11.43,1.27 149.86,1.27 152.4,3.81 158.75,10.16 158.75,20.32 158.75,107.95 153.67,113.03 8.89,113.03
  pour Bottom (isolate 1.016): 6.35,111.76 1.27,106.68 1.27,10.16 3.81,7.62 10.16,1.27 12.7,1.27 151.13,1.27 152.4,2.54 158.75,8.89 158.75,13.97 158.75,109.22 156.21,111.76 154.94,113.03 6.35,113.03
GREEN  (via drill 0.35)
  Top 0.203: U1.57 98.25,66.85 v124.46,40.64
  Bottom 0.203: v124.46,40.64 130.81,34.29 GREEN.A
  Bottom 1.016: GREEN.A 130.81,26.67 124.46,20.32 124.46,9.38 GREEN-LED.1
HOIST-RELAY  (via drill 0.35)
  Top 0.203: v66.04,57.15 68.08,57.15 69.7,55.52 73.81,55.52 78.91,60.63 78.91,61.75 U1.36
  Bottom 0.203: RELAY.2 11.43,12.7 11.43,14.88 14.88,14.88 57.15,57.15 v66.04,57.15
MISO  (via drill 0.35)
  Top 0.203: v64.77,68.58 66.04,67.31 66.04,64.77 70.67,64.77 71.16,65.25 71.91,65.25 U1.22
  Bottom 0.203: ISP1.1 54.61,71.12 62.23,71.12 v64.77,68.58
MOSI  (via drill 0.35)
  Top 0.203: v62.23,68.58 v64.77,66.04 | v67.31,66.04 71.06,66.04 71.16,65.95 71.91,65.95 U1.21
  Bottom 0.203: ISP1.4 60.96,69.85 v62.23,68.58 | v64.77,66.04 v67.31,66.04
MUZE  (via drill 0.35)
  Top 0.203: v66.04,50.8 69.14,53.9 74.19,53.9 80.91,60.62 80.91,61.75 U1.40
  Bottom 0.203: RELAY.6 30.48,22.86 58.42,50.8 v66.04,50.8
N$1
  Bottom 1.778: 12V-INPUT.1 10.65,96.52 12.7,96.52 15.24,99.06 15.24,105.04 | 15.24,105.04 CN1.PWR | D1.A 17.78,107.58 15.24,105.04
N$2
  Bottom 1.778: D1.C 30.48,109.22 IC1.1
N$3
  Top 1.778: U$1.PIO0 44.95,92.71 R3.2
N$4
  Top 1.778: R1.1 39.5,100.2 43.18,96.52 48.49,96.52 PWR-LED.A
N$5
  Bottom 1.016: RED-1.K 71.12,33.02 R15.1
N$6  (via drill 0.35)
  Top 1.016: v72.39,27.94 v81.28,27.94
  Bottom 1.016: R16.1 v72.39,27.94 | v81.28,27.94 85.09,31.75 RED-2.K
N$7  (via drill 0.35)
  Top 1.016: v91.44,25.4 v73.66,25.4
  Bottom 1.016: YELLOW-1.K 100.33,27.94 97.79,25.4 v91.44,25.4 | v73.66,25.4 71.12,25.4 R17.1
N$8  (via drill 0.35)
  Top 1.016: v110.49,24.13 109.22,22.86 v74.93,22.86
  Bottom 1.016: v110.49,24.13 113.03,26.67 YELLOW-2.K | R18.1 v74.93,22.86
N$9  (via drill 0.35)
  Top 1.016: v116.84,19.05 v73.66,19.05
  Bottom 1.016: GREEN.K 128.27,30.48 v116.84,19.05 | v73.66,19.05 R19.1
N$10  (via drill 0.35)
  Top 0.203: U1.14 69.35,69.35 68.58,68.58 67.31,68.58 v66.04,69.85
  Bottom 0.508: SKIP-BUTTON.3 38.04,74.93 60.96,74.93 v66.04,69.85
N$11
  Top 1.778: R3.1 53.24,90.4 LED2.A
N$12  (via drill 0.35)
  Top 1.016: U$1.VCC 43.33,77.62 v43.18,77.47 | v50.8,80.01 U$2.2
  Bottom 1.016: v43.18,77.47 45.72,80.01 v50.8,80.01
N$13  (via drill 0.35)
  Top 1.016: U$1.UART_RX 29.73,86.49 R21.1 25.4,87.63 v24.13,88.9 | R20.1 v19.05,86.36
  Bottom 1.016: v19.05,86.36 21.59,88.9 v24.13,88.9
N$15  (via drill 0.35)
  Top 0.203: R22.1 57.15,81.15 v57.15,82.55 | v34.29,90.17 30.41,90.17 U$1.UART_TX
  Bottom 0.203: v57.15,82.55 49.53,90.17 v34.29,90.17
OFFICE-LIGHTS  (via drill 0.35)
  Top 0.203: v66.04,45.72 73.15,52.83 74.64,52.83 82.41,60.61 82.41,61.75 U1.43
  Bottom 0.203: RELAY.9 45.72,31.75 60.96,46.99 64.77,46.99 v66.04,45.72
RED-1  (via drill 0.35)
  Top 0.203: U1.53 90.09,64.85 91.44,63.5 91.44,54.61 76.2,39.37 v76.2,38.1
  Bottom 0.203: RED-1.A v76.2,38.1
  Bottom 1.016: RED-1.A 77.47,31.75 77.47,19.05 73.66,15.24 73.66,9.38 RED-LED-1.1
RED-2  (via drill 0.35)
  Top 0.203: U1.54 90.86,65.35 92.71,63.5 92.71,48.26 v85.09,40.64
  Bottom 0.203: v85.09,40.64 85.09,38.1 87.63,35.56 RED-2.A
  Bottom 1.016: RED-2.A 87.63,20.32 85.09,17.78 85.09,9.38 RED-LED-2.1
RST  (via drill 0.35)
  Top 0.203: v45.72,68.58 49.53,68.58 55.88,62.23 63.5,62.23 69.85,55.88 73.66,55.88 76.01,58.23 U1.30
  Bottom 0.203: ISP1.5 51.93,67.31 RESET-BUTTON.3 48.2,68.58 v45.72,68.58
RXD  (via drill 0.35)
  Top 0.203: U1.2 69.43,75.35 67.31,77.47 v67.31,80.01
  Bottom 0.203: DEBUG-TERMINAL.3 66.04,81.28 v67.31,80.01
SCK  (via drill 0.35)
  Top 0.203: U1.20 71.25,66.35 71.21,66.4 70.76,66.4 69.85,67.31 66.93,67.31 65.03,69.21 62.87,69.21 v62.23,69.85
  Bottom 0.203: v62.23,69.85 63.5,68.58 63.5,67.67 60.6,67.67 59.69,68.58 54.61,68.58 ISP1.3
SK  (via drill 0.35)
  Top 0.203: U1.24 71.95,64.41 65.89,64.41 65.54,64.77 v57.15,64.77
  Bottom 0.203: 7-SEGMENT.1 22.86,57.15 49.53,57.15 v57.15,64.77
TILE-1  (via drill 0.35)
  Top 0.305: U1.97 75.51,83.24 v72.39,86.36 v61,97.75
  Bottom 0.254: SEN-1.2 v61,97.75 | R4.1 101.6,73.66 95.25,80.01 78.74,80.01 v72.39,86.36
TILE-2  (via drill 0.35)
  Top 0.203: U1.96 76.1,77.76 76.1,77 76.15,76.95 76.15,76.15 74.93,74.93 v74.93,73.66
  Top 0.305: U1.96 76.01,90.36 v71.12,95.25
  Bottom 0.203: v74.93,73.66 76.2,74.93 99.06,74.93
  Bottom 0.254: SEN-2.2 72.43,96.56 v71.12,95.25 | R5.1 129.54,69.85 127,72.39 101.6,72.39 99.06,74.93
TILE-3  (via drill 0.35)
  Top 0.203: U1.95 76.51,73.97 v76.2,73.66
  Top 0.305: U1.95 76.51,91.75 v78.74,93.98
  Bottom 0.203: v76.2,73.66 92.71,73.66
  Bottom 0.254: SEN-3.2 83.86,99.1 v78.74,93.98 | R6.1 128.27,66.04 123.19,71.12 97.79,71.12 95.25,73.66 92.71,73.66
TILE-4  (via drill 0.35)
  Top 0.203: U1.94 77.01,71.93 v76.2,71.12
  Top 0.305: U1.94 77.01,87.17 v82.55,92.71
  Bottom 0.203: R7.1 128.27,62.23 120.65,69.85 96.52,69.85 93.98,72.39 77.47,72.39 v76.2,71.12
  Bottom 0.254: SEN-4.2 95.29,105.45 v82.55,92.71
TILE-5  (via drill 0.35)
  Top 0.203: v76.2,69.85 77.51,71.16 U1.93
  Top 0.254: U1.93 77.47,77.89 77.47,86.36 82.55,91.44 v85.09,91.44
  Bottom 0.203: R8.1 128.27,58.42 118.11,68.58 95.25,68.58 92.71,71.12 77.47,71.12 v76.2,69.85
  Bottom 0.254: SEN-5.2 99.55,100.33 93.98,100.33 v85.09,91.44
TILE-6  (via drill 0.35)
  Top 0.203: v76.2,68.58 78.01,70.39 U1.92
  Top 0.254: U1.92 78.01,84.36 83.82,90.17 v88.9,90.17
  Bottom 0.203: R9.1 129.54,54.61 116.84,67.31 93.98,67.31 91.44,69.85 77.47,69.85 v76.2,68.58
  Bottom 0.254: SEN-6.2 107.17,96.52 95.25,96.52 v88.9,90.17
TILE-7  (via drill 0.35)
  Top 0.203: v77.47,68.58 77.47,69.35 78.41,70.29 78.41,77.75 U1.91
  Top 0.254: U1.91 78.51,83.59 83.82,88.9 v92.71,88.9
  Bottom 0.203: R10.1 129.54,50.8 114.3,66.04 93.98,66.04 91.44,68.58 v77.47,68.58
  Bottom 0.254: SEN-7.2 116.06,93.98 97.79,93.98 v92.71,88.9
TILE-8  (via drill 0.35)
  Top 0.203: v78.74,67.31 78.74,70.11 78.91,70.29 78.91,77.75 U1.90
  Top 0.254: U1.90 79.01,82.82 83.82,87.63 v95.25,87.63
  Bottom 0.203: R11.1 132.08,46.99 114.3,64.77 92.71,64.77 90.17,67.31 v78.74,67.31
  Bottom 0.254: SEN-8.2 123.68,90.17 96.52,90.17 95.25,88.9 v95.25,87.63
TILE-9  (via drill 0.35)
  Top 0.203: v78.74,66.04 80.01,67.31 80.01,69.85 79.27,70.59 79.27,74.19 79.51,74.43 U1.89
  Top 0.254: U1.89 79.51,82.05 83.82,86.36 v99.06,86.36
  Bottom 0.203: R12.1 113.03,63.5 90.17,63.5 87.63,66.04 v78.74,66.04
  Bottom 0.254: v99.06,86.36 100.33,87.63 132.57,87.63 SEN-9.2
TILE-10  (via drill 0.35)
  Top 0.203: v106.68,60.96 106.68,77.47 v104.14,80.01
  Top 0.254: U1.88 80.01,81.28 83.82,85.09 v102.87,85.09
  Bottom 0.203: R13.1 111.76,60.96 v106.68,60.96 | v104.14,80.01 102.87,81.28 v102.87,85.09
  Bottom 0.254: SEN-10.2 153.71,99.02 153.67,99.06 148.59,99.06 135.89,86.36 104.14,86.36 v102.87,85.09
TILE-11  (via drill 0.35)
  Top 0.203: v106.68,83.82 109.22,81.28 v109.22,59.69
  Top 0.254: U1.87 80.51,80.51 83.82,83.82 v106.68,83.82
  Bottom 0.203: R14.1 v109.22,59.69
  Bottom 0.254: SEN-11.2 146.01,87.59 142.24,83.82 v106.68,83.82
TXD  (via drill 0.35)
  Top 0.203: U1.3 68.66,74.85 66.04,77.47 66.04,80.01 64.77,81.28 v63.5,81.28
  Bottom 0.203: v63.5,81.28 DEBUG-TERMINAL.2
VCC  (via drill 0.35)
  Top 0.203: U1.61 89.17,68.85 90.17,69.85 90.17,77.47 86.36,81.28 85.09,81.28 83.82,80.01 83.82,78.8 83.91,78.7 83.91,77.95 U1.80 84.01,77.09 84.25,76.85 84.44,76.85 v85.09,76.2 | U1.100 71.12,80.74 v71.12,81.28 73.66,81.28 75.01,79.93 U1.98 75.01,76.28 74.47,75.74 73.66,75.74 v73.66,74.93 73.66,72.24 72.86,71.45 72.11,71.45 U1.10 74.7,71.35 74.93,71.12 74.93,67.31 76.51,65.73 U1.31 | U$2.3 55.17,76.91 v59.69,72.39 54.61,77.47 54.61,83.82 60.96,90.17 v64.77,90.17
  Top 1.778: v30.48,102.87 30.61,103 R1.2 40.77,103 v41.91,104.14
  Bottom 0.203: v85.09,76.2 84.18,75.29 76.05,75.29 75.7,74.93 v73.66,74.93 | v71.12,81.28 68.58,83.82 DEBUG-TERMINAL.4 | ISP1.2 v59.69,72.39
  Bottom 1.016: SEN-11.1 155.98,82.59 158.48,85.09 158.48,90.03 SEN-10.1 155.98,94.02 158.48,96.52 158.48,106.46 SEN-9.1 157.44,109.26 154.94,111.76 150.27,111.76 SEN-8.1 146.05,107.54 146.05,110.49 144.78,111.76 138.84,111.76 SEN-7.1 134.58,109.26 132.08,111.76 127.41,111.76 SEN-6.1 123.15,109.26 120.65,111.76 115.98,111.76 SEN-5.1 111.76,107.54 111.76,111.76 104.55,111.76 SEN-4.1 100.29,110.53 99.06,111.76 92.71,111.76 92.71,111.35 SEN-3.1 88.86,109.26 86.36,111.76 81.69,111.76 SEN-2.1 77.43,109.26 74.93,111.76 70.26,111.76 SEN-1.1 66,107.99 62.23,111.76 56.29,111.76 5V-INPUT.1 52.52,106.23 54.61,104.14 54.61,100.33 v64.77,90.17 DEBUG-TERMINAL.4
  Bottom 1.778: IC1.3 39.37,106.68 v41.91,104.14 44.45,101.6 46.99,101.6 50.76,105.37 5V-INPUT.1 | VCC.7 VCC.6 VCC.5 VCC.4 VCC.3 VCC.2 VCC.1 11.43,90.15 C1.1 21.61,101.62 22.86,102.87 v30.48,102.87 | VCC.7 VCC.8 VCC.9 VCC.10 VCC.11 VCC.12 | 7-SEGMENT.4 19.05,45.72 VCC.7
YELLOW-1  (via drill 0.35)
  Top 0.203: U1.55 88.11,65.75 90.96,65.75 95.25,61.46 95.25,46.99 v99.06,43.18
  Bottom 0.203: v99.06,43.18 102.87,39.37 YELLOW-1.A
  Bottom 1.016: YELLOW-1.A 102.87,24.13 99.06,20.32 99.06,9.38 YELLOW-LED-1.1
YELLOW-2  (via drill 0.35)
  Top 0.203: U1.56 88.11,66.25 90.96,66.25 114.3,42.92 v114.3,39.37
  Bottom 0.203: v114.3,39.37 115.57,38.1 YELLOW-2.A
  Bottom 1.016: YELLOW-2.A 115.57,24.13 110.49,19.05 110.49,9.38 YELLOW-LED-2.1

### Text on the board
tPlace: - | + | Tiles-game circuit board | + | (Designed by: Saad W.) | - | SK | DIO | GND | VCC | + - | + - | + - | + - | + -